# Altium project Practica RADAR.PrjPCB (part 1 of 3)
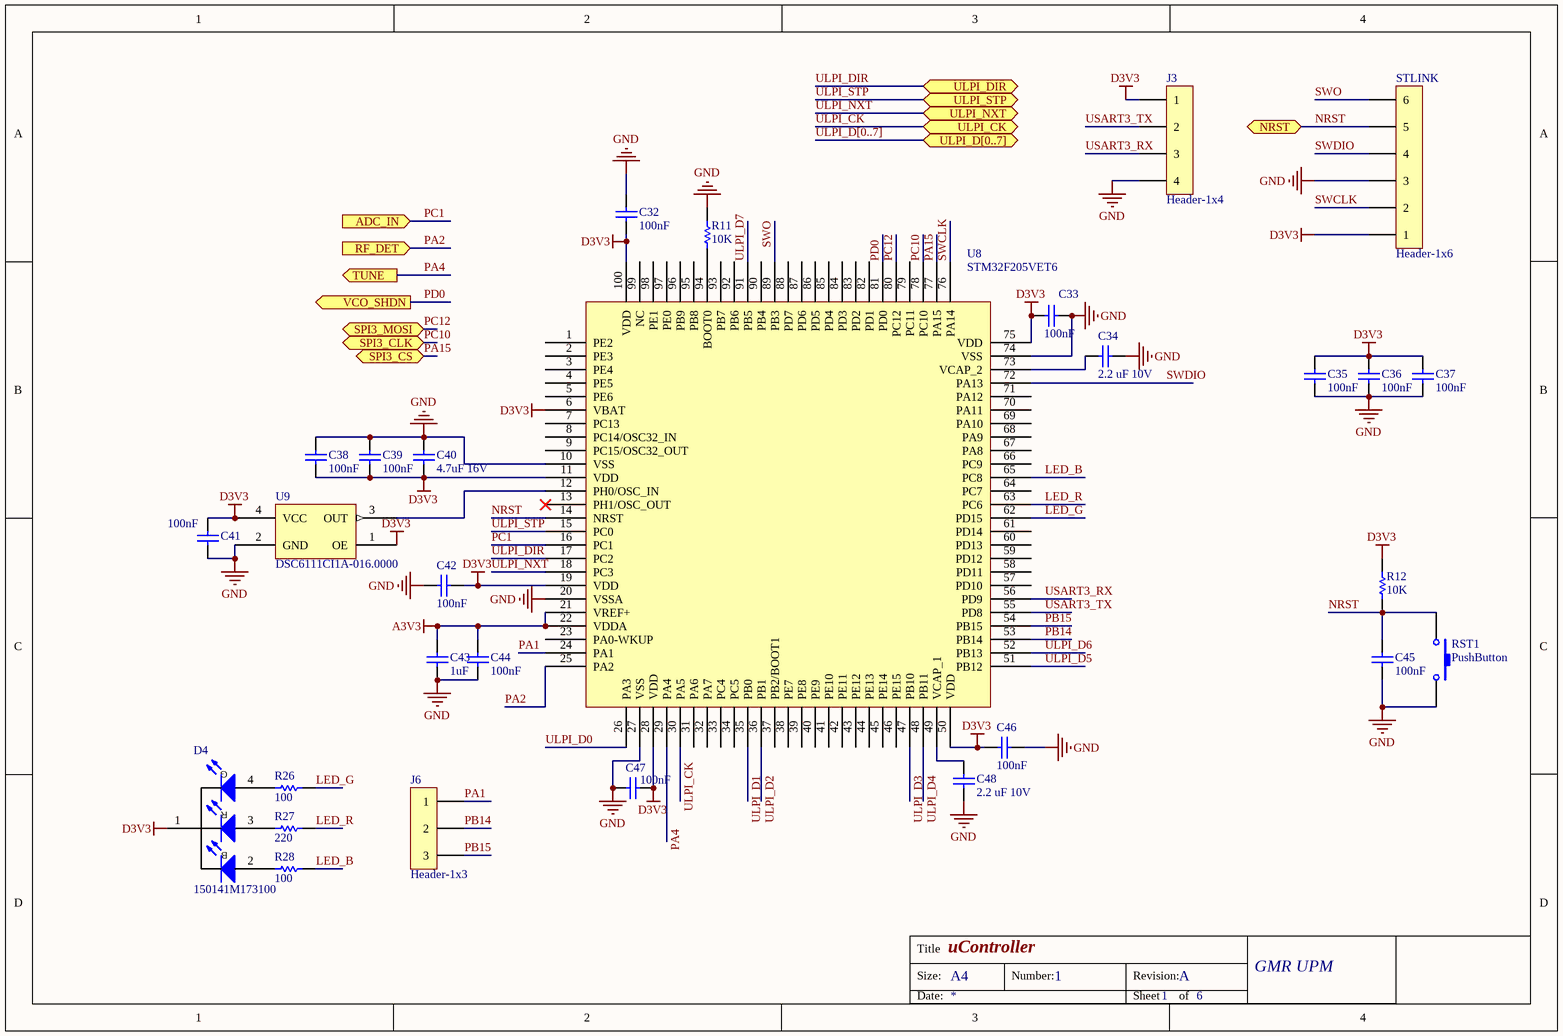
[diagram p0: uController.SchDoc]
Revision: A; ProjectName: Practica Radar; Organization: GMR UPM
6 sheets, 160 parts. Net scope: flat (ports and power ports of the same name join across sheets).
Board file: V1I1.PcbDoc
Sheets:
  uController.SchDoc
  Signal_RX.SchDoc
  Signal_TX.SchDoc
  USB PHY.SchDoc
  LowFreqSignal.SchDoc
  Power and Connectors.SchDoc

## Sheet uController.SchDoc: uController
size A4; Organization: GMR UPM; DocumentNumber: 1; Revision: A; SheetNumber: 1; SheetTotal: 6

### Parts
C32  100nF  [0603 Cap]
C33  100nF  [0603 Cap]
C34  2.2 uF 10V  [0603 Cap]
C35  100nF  [0603 Cap]
C36  100nF  [0603 Cap]
C37  100nF  [0603 Cap]
C38  100nF  [0603 Cap]
C39  100nF  [0603 Cap]
C40  4.7uF 16V  [0805 CAP]
C41  100nF  [0603 Cap]
C42  100nF  [0603 Cap]
C43  1uF  [0603 Cap]
C44  100nF  [0603 Cap]
C45  100nF  [0603 Cap]
C46  100nF  [0603 Cap]
C47  100nF  [0603 Cap]
C48  2.2 uF 10V  [0603 Cap]
D4  150141M173100  [DFN270P320X210-4N]
J3  Header-1x4  [HEADER-1X4]
J6  Header-1x3  [Header-1x3-Jumper]
R11  10K  [0603 Res]
R12  10K  [0603 Res]
R26  100  [RESC1005X04L]
R27  220  [RESC1005X04L]
R28  100  [RESC1005X04L]
RST1  PushButton  [PushButton]
STLINK  Header-1x6  [Header-1x6]
U8  STM32F205VET6  [LQFP-100]
U9  DSC6111CI1A-016.0000  [DFN 3.2x2.5]

### Ports
ADC_IN (in), NRST (bidir), RF_DET (in), SPI3_CLK (bidir), SPI3_CS (bidir), SPI3_MOSI (bidir), TUNE (out), ULPI_CK (bidir), ULPI_D[0..7] (bidir), ULPI_DIR (bidir), ULPI_NXT (bidir), ULPI_STP (bidir), VCO_SHDN (out)

### Nets
A3V3: C43.2 C44.1 U8.21(VREF+) U8.22(VDDA)
D3V3: C32.2 C33.1 C35.2 C36.2 C37.2 C38.1 C39.1 C40.1 C41.2 C42.1 C46.2 C47.1 D4.1(A) J3.1 R12.2 STLINK.1 U8.6(VBAT) U8.11(VDD) U8.19(VDD) U8.28(VDD) U8.50(VDD) U8.75(VDD) U8.100(VDD) U9.1(OE) U9.4(VCC)
GND: C32.1 C33.2 C34.1 C35.1 C36.1 C37.1 C38.2 C39.2 C40.2 C41.1 C42.2 C43.1 C44.2 C45.1 C46.1 C47.2 C48.1 J3.4 R11.2 RST1.2 STLINK.3 U8.10(VSS) U8.20(VSSA) U8.27(VSS) U8.74(VSS) U9.2(GND)
LED_B: R28.2 U8.65(PC8)
LED_G: R26.2 U8.62(PD15)
LED_R: R27.2 U8.63(PC6)
NRST: C45.2 R12.1 RST1.1 STLINK.5 U8.14(NRST) ; port NRST
PA1: J6.1 U8.24(PA1)
PA2: U8.25(PA2) ; port RF_DET
PA4: U8.29(PA4) ; port TUNE
PA15: U8.77(PA15) ; port SPI3_CS
PB14: J6.2 U8.53(PB14)
PB15: J6.3 U8.54(PB15)
PC1: U8.16(PC1) ; port ADC_IN  [project net ADC_IN]
PC10: U8.78(PC10) ; port SPI3_CLK
PC12: U8.80(PC12) ; port SPI3_MOSI
PD0: U8.81(PD0) ; port VCO_SHDN
SWCLK: STLINK.2 U8.76(PA14)
SWDIO: STLINK.4 U8.72(PA13)
SWO: STLINK.6 U8.89(PB3)
ULPI_CK: U8.30(PA5) ; port ULPI_CK
ULPI_D0: U8.26(PA3)
ULPI_D1: U8.35(PB0)
ULPI_D2: U8.36(PB1)
ULPI_D3: U8.47(PB10)
ULPI_D4: U8.48(PB11)
ULPI_D5: U8.51(PB12)
ULPI_D6: U8.52(PB13)
ULPI_D7: U8.91(PB5)
ULPI_DIR: U8.17(PC2) ; port ULPI_DIR
ULPI_NXT: U8.18(PC3) ; port ULPI_NXT
ULPI_STP: U8.15(PC0) ; port ULPI_STP
USART3_RX: J3.3 U8.56(PD9)
USART3_TX: J3.2 U8.55(PD8)
NetC34_2: C34.2 U8.73(VCAP_2)
NetC48_2: C48.2 U8.49(VCAP_1)
NetD4_2: D4.2(C) R28.1
NetD4_3: D4.3(C) R27.1
NetD4_4: D4.4(C) R26.1
NetR11_1: R11.1 U8.94(BOOT0)
NetU8_12: U8.12(PH0/OSC_IN) U9.3(OUT)

Not connected (* = marked no-connect by the designer): U8 1(PE2) 2(PE3) 3(PE4) 4(PE5) 5(PE6) 7(PC13) 8(PC14/OSC32_IN) 9(PC15/OSC32_OUT) 13(PH1/OSC_OUT)* 23(PA0-WKUP) 31(PA6) 32(PA7) 33(PC4) 34(PC5) 37(PB2/BOOT1) 38(PE7) 39(PE8) 40(PE9) 41(PE10) 42(PE11) 43(PE12) 44(PE13) 45(PE14) 46(PE15) 57(PD10) 58(PD11) 59(PD12) 60(PD13) 61(PD14) 64(PC7) 66(PC9) 67(PA8) 68(PA9) 69(PA10) 70(PA11) 71(PA12) 79(PC11) 82(PD1) 83(PD2) 84(PD3) 85(PD4) 86(PD5) 87(PD6) 88(PD7) 90(PB4) 92(PB6) 93(PB7) 95(PB8) 96(PB9) 97(PE0) 98(PE1) 99(NC)

### Buses and harness runs
bus ULPI_D[0..7] = port ULPI_D[0..7]

### Notes on the sheet
- Title
- Size:
- A4
- Number:
- Revision:
- Date:
- Sheet
- of
- (in symbol 150141M173100) G; R; B

### Library data of the parts
C32 C33 C35-C39 C41 C42 C44-C47 = C0603C104K4RACTU: CAP CER 0.1UF 16V X7R 0603; Manufacturer: KEMET; Capacitance: 0.1µF; Tolerance: ±10%; Supplier 1: Digi-Key; Manufacturer Part Number: C0603C104K4RACTU; RoHS: RoHS Compliant; Category: Capacitors; Stock 1: 4491346; Pricing 1: 1=0.09, 10=0.022, 25=0.016, 50=0.0122, 100=0.01, 250=0.00836, 500=0.0071, 1000=0.00559 (EUR); Packaging: Digi-Reel®; Part Status: Active; Voltage - Rated: 16V; Temperature Coefficient: X7R; Operating Temperature: -55°C ~ 125°C; Features: -; Ratings: -; Applications: General Purpose; Failure Rate: -; Mounting Type: Surface Mount, MLCC; Package / Case: 0603 (1608 Metric); Size / Dimension: 0.063" L x 0.031" W (1.60mm x 0.80mm); Height - Seated (Max): -; Thickness (Max): 0.034" (0.87mm); Lead Spacing: -; Lead Style: -; ComponentLink1URL: http://www.kemet.com/docfinder?Partnumber=C0603C104K4RACTU; ComponentLink1Description: http://www.kemet.com/docfinder?Partnumber=C0603C104K4RACTU; Supplier Part Number 1: 399-1096-6-ND
C34 C48 = CL10B225KP8NNNC: CAP CER 2.2UF 10V X7R 0603; Manufacturer: Samsung Electro-Mechanics America, Inc.; Capacitance: 2.2µF; Tolerance: ±10%; Supplier 1: Digi-Key; Manufacturer Part Number: CL10B225KP8NNNC; RoHS: RoHS Compliant; Category: Capacitors; Stock 1: 226342; Pricing 1: 1=0.15, 10=0.105, 25=0.0764, 50=0.0592, 100=0.0491, 250=0.04068, 500=0.03444, 1000=0.02851 (EUR); Packaging: Digi-Reel®; Part Status: Active; Voltage - Rated: 10V; Temperature Coefficient: X7R; Operating Temperature: -55°C ~ 125°C; Features: -; Ratings: -; Applications: General Purpose; Mounting Type: Surface Mount, MLCC; Package / Case: 0603 (1608 Metric); Size / Dimension: 0.063" L x 0.031" W (1.60mm x 0.80mm); Height - Seated (Max): -; Thickness (Max): 0.035" (0.90mm); Lead Spacing: -; Lead Style: -; ComponentLink1URL: http://www.samsungsem.com/kr/support/product-search/mlcc/__icsFiles/afieldfile/2016/08/18/S_CL10B225KP8NNNC.pdf; ComponentLink1Description: http://www.samsungsem.com/kr/support/product-search/mlcc/__icsFiles/afieldfile/2016/08/18/S_CL10B225KP8NNNC.pdf; Supplier Part Number 1: 1276-1134-6-ND
C40 = GRM21BR71C475KE51L: CAP CER 4.7UF 16V X7R 0805; Manufacturer: Murata Electronics North America; Capacitance: 4.7µF; Tolerance: ±10%; Supplier 1: Digi-Key; Manufacturer Part Number: GRM21BR71C475KE51L; RoHS: RoHS Compliant; Category: Capacitors; Stock 1: 5810; Pricing 1: 1=0.16, 10=0.111, 25=0.0816, 50=0.0666, 100=0.0562, 250=0.04588, 500=0.03848, 1000=0.03403 (EUR); Part Status: Active; Voltage - Rated: 16V; Temperature Coefficient: X7R; Operating Temperature: -55°C ~ 125°C; Features: -; Ratings: -; Applications: General Purpose; Failure Rate: -; Mounting Type: Surface Mount, MLCC; Package / Case: 0805 (2012 Metric); Size / Dimension: 0.079" L x 0.049" W (2.00mm x 1.25mm); Height - Seated (Max): -; Thickness (Max): 0.055" (1.40mm); Lead Spacing: -; Lead Style: -; Supplier Part Number 1: 490-14466-6-ND
C43 = CL10B105MO8NNWC: CAP CER 1UF 16V X7R 0603; Manufacturer: Samsung Electro-Mechanics America, Inc.; Capacitance: 1µF; Tolerance: ±20%; Supplier 1: Digi-Key; Manufacturer Part Number: CL10B105MO8NNWC; RoHS: RoHS Compliant; Category: Capacitors; Stock 1: 77746; Pricing 1: 1=0.09, 10=0.02, 25=0.0144, 50=0.0108, 100=0.0089, 250=0.00744, 500=0.00636, 1000=0.00499 (EUR); Packaging: Digi-Reel®; Part Status: Active; Voltage - Rated: 16V; Temperature Coefficient: X7R; Operating Temperature: -55°C ~ 125°C; Features: -; Ratings: -; Applications: General Purpose; Mounting Type: Surface Mount, MLCC; Package / Case: 0603 (1608 Metric); Size / Dimension: 0.063" L x 0.031" W (1.60mm x 0.80mm); Height - Seated (Max): -; Thickness (Max): 0.035" (0.90mm); Lead Spacing: -; Lead Style: -; ComponentLink1URL: http://www.samsungsem.com/kr/support/library/product-catalog/__icsFiles/afieldfile/2016/09/27/MLCC.pdf; ComponentLink1Description: http://www.samsungsem.com/kr/support/library/product-catalog/__icsFiles/afieldfile/2016/09/27/MLCC.pdf; Supplier Part Number 1: 1276-6524-6-ND
D4 = 150141M173100: LED RGB CLEAR 1411 SMD; Manufacturer: Wurth Electronics Inc.; Color: Red, Green, Blue (RGB); Configuration: Common Anode; Lens Color: Colorless; Millicandela Rating: 270mcd Red, 950mcd Green, 230mcd Blue; Lens Style/Size: Round with Flat Top, 2.40mm; Voltage - Forward (Vf) (Typ): 2V Red, 3.2V Green, 3.2V Blue; Current - Test: 20mA Red, 20mA Green, 20mA Blue; Viewing Angle: 120°; Wavelength - Dominant: 625nm Red, 520nm Green, 470nm Blue; Wavelength - Peak: 635nm Red, 515nm Green, 465nm Blue; Supplier 1: Digi-Key; Manufacturer Part Number: 150141M173100; RoHS: RoHS Compliant; Category: Optoelectronics; Stock 1: 7809; Pricing 1: 1=0.4, 100=0.3462, 500=0.2867 (EUR); Packaging: Cut Tape (CT); Part Status: Active; Lens Transparency: Clear; Mounting Type: Surface Mount; Features: -; Package / Case: 1411 (3528 Metric); Supplier Device Package: 3528; Size / Dimension: 3.50mm L x 2.80mm W; Height (Max): 2.10mm; ComponentLink1URL: http://katalog.we-online.de/led/datasheet/150141M173100.pdf; ComponentLink1Description: http://katalog.we-online.de/led/datasheet/150141M173100.pdf; Supplier Part Number 1: 732-4998-1-ND
R11 R12 = RC0603FR-0710KL: RES SMD 10K OHM 1% 1/10W 0603; Manufacturer: Yageo; Power (Watts): 0.1W, 1/10W; Temperature Coefficient: ±100ppm/°C; Supplier 1: Digi-Key; Manufacturer Part Number: RC0603FR-0710KL; RoHS: RoHS Compliant; Category: Resistors; Stock 1: 17023109; Pricing 1: 1=0.09, 10=0.012, 25=0.0088, 50=0.0066, 100=0.0049, 250=0.00372, 500=0.00296, 1000=0.00218 (EUR); Packaging: Cut Tape (CT); Part Status: Active; Resistance (Ohms): 10k; Tolerance: ±1%; Composition: Thick Film; Features: Moisture Resistant; Operating Temperature: -55°C ~ 155°C; Package / Case: 0603 (1608 Metric); Supplier Device Package: 0603; Size / Dimension: 0.063" L x 0.031" W (1.60mm x 0.80mm); Height - Seated (Max): 0.022" (0.55mm); Failure Rate: -; ComponentLink1URL: http://www.yageo.com/documents/recent/PYu-RC_Group_51_RoHS_L_7.pdf; ComponentLink1Description: http://www.yageo.com/documents/recent/PYu-RC_Group_51_RoHS_L_7.pdf; Supplier Part Number 1: 311-10.0KHRCT-ND
R26 R28 = MCR01MRTF1000: RES 100 OHM 1/16W 1% 0402 SMD; Manufacturer: Rohm Semiconductor; Power (Watts): 0.063W, 1/16W; Temperature Coefficient: ±100ppm/°C; Supplier 1: Digi-Key; Supplier Part Number 1: RHM100CDCT-ND; Manufacturer Part Number: MCR01MRTF1000; RoHS: RoHS Compliant; Category: Resistors; Stock 1: 128227; Pricing 1: 1=0.09, 10=0.011, 25=0.008, 100=0.0046, 250=0.00348, 500=0.00278, 1000=0.00205, 5000=0.00147 (EUR); Packaging: Cut Tape (CT); Resistance (Ohms): 100; Tolerance: ±1%; Composition: Thick Film; Features: -; Operating Temperature: -55°C ~ 155°C; Package / Case: 0402 (1005 Metric); Supplier Device Package: 0402 (1005 Metric); Size / Dimension: 0.039" L x 0.020" W (1.00mm x 0.50mm); Height: 0.016" (0.40mm); Number of Terminations: 2; ComponentLink1URL: http://rohmfs.rohm.com/en/products/databook/datasheet/passive/resistor/chip_resistor/mcr_g.pdf; ComponentLink1Description: http://rohmfs.rohm.com/en/products/databook/datasheet/passive/resistor/chip_resistor/mcr_g.pdf
R27 = RC0402FR-07220RL: RES SMD 220 OHM 1% 1/16W 0402; Manufacturer: Yageo; Power (Watts): 0.063W, 1/16W; Temperature Coefficient: ±100ppm/°C; Supplier 1: Digi-Key; Manufacturer Part Number: RC0402FR-07220RL; RoHS: RoHS Compliant; Category: Resistors; Stock 1: 624682; Pricing 1: 1=0.09, 10=0.011, 25=0.0084, 50=0.0062, 100=0.0046, 250=0.00348, 500=0.00278, 1000=0.00205, 5000=0.00147 (EUR); Packaging: Cut Tape (CT); Part Status: Active; Resistance (Ohms): 220; Tolerance: ±1%; Composition: Thick Film; Features: Moisture Resistant; Operating Temperature: -55°C ~ 155°C; Package / Case: 0402 (1005 Metric); Supplier Device Package: 0402; Size / Dimension: 0.039" L x 0.020" W (1.00mm x 0.50mm); Height - Seated (Max): 0.016" (0.40mm); Number of Terminations: 2; Failure Rate: -; ComponentLink1URL: http://www.yageo.com/NewPortal/yageodocoutput?fileName=/pdf/R-Chip/PYu-RC_Group_51_RoHS_L_4.pdf; ComponentLink1Description: http://www.yageo.com/NewPortal/yageodocoutput?fileName=/pdf/R-Chip/PYu-RC_Group_51_RoHS_L_4.pdf; Supplier Part Number 1: 311-220LRCT-ND
U8 = STM32F205VET6: IC MCU 32BIT 512KB FLASH 100LQFP; Manufacturer: STMicroelectronics; Core Processor: ARM® Cortex®-M3; Core Size: 32-Bit; Speed: 120MHz; Connectivity: CAN, I²C, IrDA, LIN, MMC, SPI, UART/USART, USB OTG; Peripherals: Brown-out Detect/Reset, DMA, I²S, LCD, POR, PWM, WDT; Number of I/O: 82; Program Memory Size: 512KB (512K x 8); RAM Size: 132K x 8; Voltage - Supply (Vcc/Vdd): 1.8 V ~ 3.6 V; Data Converters: A/D 16x12b; D/A 2x12b; Oscillator Type: Internal; Supplier 1: Digi-Key; Manufacturer Part Number: STM32F205VET6; RoHS: RoHS Compliant; Category: Integrated Circuits (ICs); Stock 1: 1188; Pricing 1: 1=9.78, 10=8.83, 100=7.3108, 500=6.36612, 1000=5.54468 (EUR); Packaging: Tray; Part Status: Active; Program Memory Type: FLASH; EEPROM Size: -; Operating Temperature: -40°C ~ 85°C (TA); Package / Case: 100-LQFP; Supplier Device Package: 100-LQFP (14x14); ComponentLink1URL: http://media.digikey.com/pdf/Data%20Sheets/ST%20Microelectronics%20PDFS/STM32F20(5,7)xx.pdf; ComponentLink1Description: http://media.digikey.com/pdf/Data%20Sheets/ST%20Microelectronics%20PDFS/STM32F20(5,7)xx.pdf; Supplier Part Number 1: 497-11160-ND
U9 = DSC6111CI1A-016.0000: ULTRA-LOW POWER,MEMS OSCILLATOR,; Manufacturer: Microchip Technology; Frequency: 16MHz; Function: Standby (Power Down); Output: CMOS; Voltage - Supply: 1.71 V ~ 3.63 V; Frequency Stability: ±25ppm; Current - Supply (Max): 3mA (Typ); Current - Supply (Disable) (Max): 10.5µA; Supplier 1: Digi-Key; Manufacturer Part Number: DSC6111CI1A-016.0000; RoHS: RoHS Compliant; Category: Crystals, Oscillators, Resonators; Stock 1: 957; Pricing 1: 1=0.81, 25=0.6744, 100=0.6514 (EUR); Packaging: Tube; Part Status: Active; Type: MEMS (Silicon); Operating Temperature: -40°C ~ 85°C; Ratings: AEC-Q100; Mounting Type: Surface Mount; Package / Case: 4-SMD, No Lead; Size / Dimension: 0.126" L x 0.098" W (3.20mm x 2.50mm); Height - Seated (Max): 0.035" (0.90mm); ComponentLink1URL: http://www.microchip.com/mymicrochip/filehandler.aspx?ddocname=en587492; ComponentLink1Description: http://www.microchip.com/mymicrochip/filehandler.aspx?ddocname=en587492; Supplier Part Number 1: DSC6111CI1A-016.0000-ND

## Sheet Signal_RX.SchDoc: Signal_RX
size A4; Organization: GMR UPM; DocumentNumber: 2; Revision: A; SheetNumber: 2; SheetTotal: 6
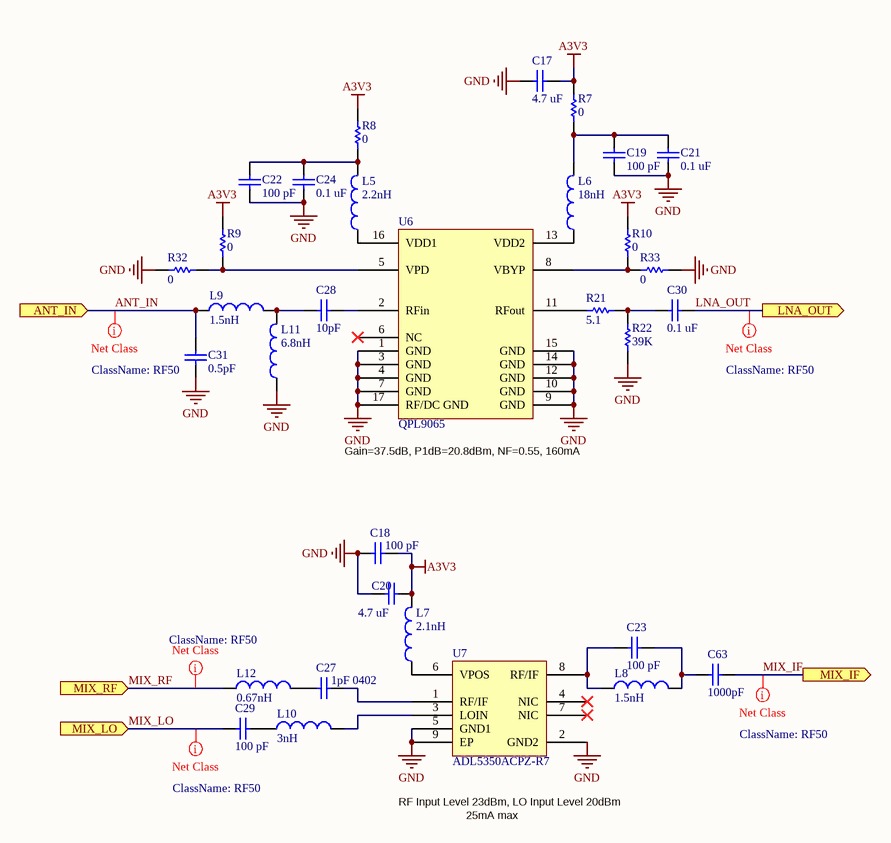
[diagram p1: Signal_RX.SchDoc]

### Parts
C17  4.7 uF  [CAPC1608X10L]
C18  100 pF  [CAPC1005X05L]
C19  100 pF  [CAPC1005X05L]
C20  4.7 uF  [CAPC1608X10L]
C21  0.1 uF  [CAPC1005X05L]
C22  100 pF  [CAPC1005X05L]
C23  100 pF  [CAPC1005X05L]
C24  0.1 uF  [CAPC1005X05L]
C27  1pF 0402  [CAPC1005X05L]
C28  10pF  [CAPC1005X05L]
C29  100 pF  [CAPC1005X05L]
C30  0.1 uF  [CAPC1005X05L]
C31  0.5pF  [CAPC1005X05L]
C63  1000pF  [CAPC1005X05L]
L5  2.2nH  [INDC1005X06L]
L6  18nH  [INDC1811X10L 0603CS]
L7  2.1nH  [INDC0905X05N-0302CS]
L8  1.5nH  [INDC1005X06L]
L9  1.5nH  [INDC1005X06L]
L10  3nH  [INDC1005X06L]
L11  6.8nH  [INDC1005X06L]
L12  0.67nH  [INDC0905X05N-0302CS]
R7  0  [RESC1005X04L]
R8  0  [RESC1005X04L]
R9  0  [RESC1005X04L]
R10  0  [RESC1005X04L]
R21  5.1  [RESC1005X04L]
R22  39K  [RESC1005X04L]
R32  0  [RESC1005X04L]
R33  0  [RESC1005X04L]
U6  QPL9065  [QFN50P350X350X86_HS-17N-qorvo]
U7  ADL5350ACPZ-R7  [SON50P200X80_HS-9N]

### Ports
ANT_IN (in), LNA_OUT (out), MIX_IF (out), MIX_LO (in), MIX_RF (in)

### Nets
A3V3: C17.2 C18.2 C20.1 L7.2 R7.2 R8.1 R9.2 R10.1
GND: C17.1 C18.1 C19.2 C20.2 C21.1 C22.2 C24.1 C31.1 L11.1 R22.1 R32.2 R33.1 U6.1(GND) U6.3(GND) U6.4(GND) U6.7(GND) U6.9(GND) U6.10(GND) U6.12(GND) U6.14(GND) U6.15(GND) U6.17(RF/DC_GND) U7.2(GND2) U7.5(GND1) U7.9(EP)
ANT_IN: C31.2 L9.1 ; port ANT_IN
LNA_OUT: C30.1 ; port LNA_OUT
MIX_IF: C63.2 ; port MIX_IF
MIX_LO: C29.1 ; port MIX_LO
MIX_RF: L12.1 ; port MIX_RF
NetC19_1: C19.1 C21.2 L6.2 R7.1
NetC22_1: C22.1 C24.2 L5.2 R8.2
NetC23_1: C23.1 L8.1 U7.8(RF/IF)
NetC23_2: C23.2 C63.1 L8.2
NetC27_1: C27.1 L12.2
NetC27_2: C27.2 U7.1(RF/IF)
NetC28_1: C28.1 L9.2 L11.2
NetC28_2: C28.2 U6.2(RFin)
NetC29_2: C29.2 L10.1
NetC30_2: C30.2 R21.2 R22.2
NetL5_1: L5.1 U6.16(VDD1)
NetL6_1: L6.1 U6.13(VDD2)
NetL7_1: L7.1 U7.6(VPOS)
NetL10_2: L10.2 U7.3(LOIN)
NetR9_1: R9.1 R32.1 U6.5(VPD)
NetR10_2: R10.2 R33.2 U6.8(VBYP)
NetR21_1: R21.1 U6.11(RFout)

Not connected (* = marked no-connect by the designer): U6 6(NC)*; U7 4(NIC)* 7(NIC)*

### Layout directives
net class RF50: ANT_IN, LNA_OUT, MIX_IF, MIX_LO, MIX_RF

### Notes on the sheet
- (near U6) Gain=37.5dB, P1dB=20.8dBm, NF=0.55, 160mA
- RF Input Level 23dBm, LO Input Level 20dBm
- 25mA max
- Title
- Size:
- A4
- Number:
- Revision:
- Date:
- Sheet
- of

### Library data of the parts
C17 = GRM188R61C475KAAJD_1: Multilayer Ceramic Capacitors MLCC - SMD/SMT 0603 4.7uF 16volts X5R + - 10%; Manufacturer: Murata Electronics; Type: General Purpose MLCC; Voltage Rating DC: 16 V; Product Status: New Product; Voltage - Rated: 16V; Supplier 1: Mouser; Manufacturer Part Number: GRM188R61C475KAAJD; RoHS: RoHS Compliant; Category: Multilayer Ceramic Capacitors MLCC - SMD/SMT; Stock 1: 10870; Pricing 1: 1=0.262, 10=0.110, 100=0.066, 1000=0.056, 4000=0.042, 8000=0.040, 24000=0.037, 48000=0.035, 100000=0.030 (EUR); Capacitance: 4.7 uF; Height: 0.8 mm; Length: 1.6 mm; Package/Case: 0603 (1608 metric); Packaging: Reel; Product: General Type MLCCs; Series: GRM; Termination Style: SMD/SMT; Tolerance: 10 %; Width: 0.8 mm; Brand: Murata Electronics; Case Code - in: 0603; Case Code - mm: 1608; Dielectric: X5R; Maximum Operating Temperature: + 85 C; Minimum Operating Temperature: - 55 C; RoHS - Mouser: Y; Minimum Order Quantity: 1; Reeling: True; ComponentLink1URL: http://www.mouser.com/ds/2/281/c02e-2905.pdf; ComponentLink1Description: http://www.mouser.com/ds/2/281/c02e-2905.pdf; Supplier 2: Digi-Key; Stock 2: 0; Pricing 2: 1=0.27, 10=0.224, 25=0.154, 50=0.1262, 100=0.112, 250=0.08404, 500=0.07424, 1000=0.06582 (EUR); Temperature Coefficient: X5R; Mounting Type: Surface Mount, MLCC; Operating Temperature: -55°C ~ 85°C; Applications: General Purpose; Ratings: -; Package / Case: 0603 (1608 Metric); Size / Dimension: 0.063" L x 0.031" W (1.60mm x 0.80mm); Height - Seated (Max): -; Thickness (Max): 0.037" (0.95mm); Lead Spacing: -; Features: -; Lead Style: -; ComponentLink2URL: http://www.murata.com/~/media/webrenewal/support/library/catalog/products/capacitor/mlcc/c02e.ashx; ComponentLink2Description: http://www.murata.com/~/media/webrenewal/support/library/catalog/products/capacitor/mlcc/c02e.ashx; Supplier Part Number 1: 81-GRM188R61C475KAJD; Supplier Part Number 2: 490-10481-1-ND
C18 C19 C22 C23 C29 = GRM1555C1H101GA01D: CAP CER 100PF 50V NP0 0402; Manufacturer: Murata Electronics North America; Tolerance: ±2%; Temperature Coefficient: C0G, NP0; Supplier 1: Digi-Key; Manufacturer Part Number: GRM1555C1H101GA01D; RoHS: RoHS Compliant; Category: Capacitors; Stock 1: 145962; Pricing 1: 1=0.09, 10=0.038, 50=0.0208, 100=0.0177, 250=0.01444, 500=0.01236, 1000=0.00963, 5000=0.00803 (EUR); Packaging: Cut Tape (CT); Capacitance: 100pF; Voltage - Rated: 50V; Mounting Type: Surface Mount, MLCC; Operating Temperature: -55°C ~ 125°C; Applications: General Purpose; Ratings: -; Package / Case: 0402 (1005 Metric); Size / Dimension: 0.039" L x 0.020" W (1.00mm x 0.50mm); Height - Seated (Max): -; Thickness (Max): 0.022" (0.55mm); Lead Spacing: -; Features: -; Lead Style: -; ComponentLink1URL: http://www.murata.com/~/media/webrenewal/support/library/catalog/products/capacitor/mlcc/c02e.ashx; ComponentLink1Description: http://www.murata.com/~/media/webrenewal/support/library/catalog/products/capacitor/mlcc/c02e.ashx; Supplier Part Number 1: 490-6188-1-ND
C20 = GRM188R61C475KAAJD: Multilayer Ceramic Capacitors MLCC - SMD/SMT 0603 4.7uF 16volts X5R + - 10%; Manufacturer: Murata Electronics; Type: General Purpose MLCC; Voltage Rating DC: 16 V; Product Status: New Product; Voltage - Rated: 16V; Supplier 1: Mouser; Manufacturer Part Number: GRM188R61C475KAAJD; RoHS: RoHS Compliant; Category: Multilayer Ceramic Capacitors MLCC - SMD/SMT; Stock 1: 10870; Pricing 1: 1=0.262, 10=0.110, 100=0.066, 1000=0.056, 4000=0.042, 8000=0.040, 24000=0.037, 48000=0.035, 100000=0.030 (EUR); Capacitance: 4.7 uF; Height: 0.8 mm; Length: 1.6 mm; Package/Case: 0603 (1608 metric); Packaging: Reel; Product: General Type MLCCs; Series: GRM; Termination Style: SMD/SMT; Tolerance: 10 %; Width: 0.8 mm; Brand: Murata Electronics; Case Code - in: 0603; Case Code - mm: 1608; Dielectric: X5R; Maximum Operating Temperature: + 85 C; Minimum Operating Temperature: - 55 C; RoHS - Mouser: Y; Minimum Order Quantity: 1; Reeling: True; ComponentLink1URL: http://www.mouser.com/ds/2/281/c02e-2905.pdf; ComponentLink1Description: http://www.mouser.com/ds/2/281/c02e-2905.pdf; Supplier 2: Digi-Key; Stock 2: 0; Pricing 2: 1=0.27, 10=0.224, 25=0.154, 50=0.1262, 100=0.112, 250=0.08404, 500=0.07424, 1000=0.06582 (EUR); Temperature Coefficient: X5R; Mounting Type: Surface Mount, MLCC; Operating Temperature: -55°C ~ 85°C; Applications: General Purpose; Ratings: -; Package / Case: 0603 (1608 Metric); Size / Dimension: 0.063" L x 0.031" W (1.60mm x 0.80mm); Height - Seated (Max): -; Thickness (Max): 0.037" (0.95mm); Lead Spacing: -; Features: -; Lead Style: -; ComponentLink2URL: http://www.murata.com/~/media/webrenewal/support/library/catalog/products/capacitor/mlcc/c02e.ashx; ComponentLink2Description: http://www.murata.com/~/media/webrenewal/support/library/catalog/products/capacitor/mlcc/c02e.ashx; Supplier Part Number 1: 81-GRM188R61C475KAJD; Supplier Part Number 2: 490-10481-1-ND
C21 C24 C30 = CL05B104KO5NNNC: CAP CER 0.1UF 16V 10% X7R 0402; Manufacturer: Samsung Electro-Mechanics America, Inc; Capacitance: 0.1µF; Supplier 1: Digi-Key; Supplier Part Number 1: 1276-1001-1-ND; Manufacturer Part Number: CL05B104KO5NNNC; RoHS: RoHS Compliant; Category: Capacitors; Stock 1: 4178896; Pricing 1: 1=0.09, 10=0.013, 25=0.0096, 100=0.0061, 500=0.00424, 1000=0.0033, 2500=0.00297, 5000=0.00275 (EUR); Packaging: Cut Tape (CT); Tolerance: ±10%; Voltage - Rated: 16V; Temperature Coefficient: X7R; Mounting Type: Surface Mount, MLCC; Operating Temperature: -55°C ~ 125°C; Applications: General Purpose; Ratings: -; Package / Case: 0402 (1005 Metric); Size / Dimension: 0.039" L x 0.020" W (1.00mm x 0.50mm); Height - Seated (Max): -; Thickness (Max): 0.022" (0.55mm); Lead Spacing: -; Features: -; Lead Style: -; ComponentLink1URL: http://www.samsungsem.com/servlet/FileDownload?type=spec&file=CL05B104KO5NNNC.pdf; ComponentLink1Description: http://www.samsungsem.com/servlet/FileDownload?type=spec&file=CL05B104KO5NNNC.pdf
C27 = GRM1555C1H1R0CA01D: CAP CER 1PF 50V C0G/NP0 0402
C28 = GRM1555C1H100JA01D: CAP CER 10PF 50V C0G/NP0 0402; Manufacturer: Murata Electronics North America; Tolerance: ±5%; Temperature Coefficient: C0G, NP0; Supplier 1: Digi-Key; Manufacturer Part Number: GRM1555C1H100JA01D; RoHS: RoHS Compliant; Category: Capacitors; Stock 1: 670265; Pricing 1: 1=0.18, 10=0.025, 100=0.0112, 500=0.008, 1000=0.00629, 2500=0.00572, 5000=0.00526 (EUR); Packaging: Cut Tape (CT); Part Status: Active; Voltage - Rated: 50V; Operating Temperature: -55°C ~ 125°C; Features: -; Ratings: -; Applications: General Purpose; Mounting Type: Surface Mount, MLCC; Package / Case: 0402 (1005 Metric); Size / Dimension: 0.039" L x 0.020" W (1.00mm x 0.50mm); Height - Seated (Max): -; Thickness (Max): 0.022" (0.55mm); Lead Spacing: -; Lead Style: -; ComponentLink1URL: http://www.murata.com/~/media/webrenewal/support/library/catalog/products/capacitor/mlcc/c02e.ashx?la=en-us; ComponentLink1Description: http://www.murata.com/~/media/webrenewal/support/library/catalog/products/capacitor/mlcc/c02e.ashx?la=en-us; Supplier Part Number 1: 490-5921-1-ND
C31 = GJM1555C1HR50BB01D: CAP CER 0.5PF 50V C0G/NP0 0402; Manufacturer: Murata Electronics North America; Tolerance: ±0.1pF; Temperature Coefficient: C0G, NP0; Supplier 1: Digi-Key; Manufacturer Part Number: GJM1555C1HR50BB01D; RoHS: RoHS Compliant; Category: Capacitors; Stock 1: 43253; Pricing 1: 1=0.14, 10=0.101, 100=0.0474, 500=0.03328, 1000=0.02756, 2500=0.02564, 5000=0.02346 (EUR); Packaging: Cut Tape (CT); Part Status: Active; Voltage - Rated: 50V; Operating Temperature: -55°C ~ 125°C; Features: High Q, Low Loss; Ratings: -; Applications: RF, Microwave, High Frequency; Mounting Type: Surface Mount, MLCC; Package / Case: 0402 (1005 Metric); Size / Dimension: 0.039" L x 0.020" W (1.00mm x 0.50mm); Height - Seated (Max): -; Thickness (Max): 0.022" (0.55mm); Lead Spacing: -; Lead Style: -; ComponentLink1URL: http://search.murata.co.jp/Ceramy/image/img/A01X/G101/ENG/GJM1555C1HR50BB01-01.pdf; ComponentLink1Description: http://search.murata.co.jp/Ceramy/image/img/A01X/G101/ENG/GJM1555C1HR50BB01-01.pdf; Supplier Part Number 1: 490-6077-1-ND
C63 = GRM1555C1H102JA01D: CAP CER 1000PF 50V C0G/NP0 0402; Manufacturer: Murata Electronics North America; Tolerance: ±5%; Temperature Coefficient: C0G, NP0; Supplier 1: Digi-Key; Manufacturer Part Number: GRM1555C1H102JA01D; RoHS: RoHS Compliant; Category: Capacitors; Stock 1: 29189; Pricing 1: 1=0.12, 10=0.054, 100=0.0242, 500=0.01726, 1000=0.01355, 2500=0.01232, 5000=0.01134 (EUR); Packaging: Cut Tape (CT); Part Status: Active; Voltage - Rated: 50V; Operating Temperature: -55°C ~ 125°C; Features: -; Ratings: -; Applications: General Purpose; Mounting Type: Surface Mount, MLCC; Package / Case: 0402 (1005 Metric); Size / Dimension: 0.039" L x 0.020" W (1.00mm x 0.50mm); Height - Seated (Max): -; Thickness (Max): 0.022" (0.55mm); Lead Spacing: -; Lead Style: -; ComponentLink1URL: http://www.murata.com/~/media/webrenewal/support/library/catalog/products/capacitor/mlcc/c02e.ashx; ComponentLink1Description: http://www.murata.com/~/media/webrenewal/support/library/catalog/products/capacitor/mlcc/c02e.ashx; Supplier Part Number 1: 490-3244-1-ND
L5 = LQW15AN2N2C10D: FIXED IND 2.2NH 1A 27 MOHM SMD; Manufacturer: Murata Electronics North America; Type: Wirewound; Material - Core: Non-Magnetic; Tolerance: ±0.2nH; Shielding: Unshielded; DC Resistance (DCR): 27 mOhm Max; Q @ Freq: 25 @ 250MHz; Supplier 1: Digi-Key; Manufacturer Part Number: LQW15AN2N2C10D; RoHS: RoHS Compliant; Category: Inductors, Coils, Chokes; Stock 1: 98779; Pricing 1: 1=0.17, 10=0.154, 100=0.103, 500=0.08586, 1000=0.07212, 2500=0.06182 (EUR); Packaging: Cut Tape (CT); Part Status: Active; Ratings: -; Operating Temperature: -55°C ~ 125°C; Mounting Type: Surface Mount; Package / Case: 0402 (1005 Metric); Supplier Device Package: 0402 (1005 Metric); Size / Dimension: 0.039" L x 0.020" W (1.00mm x 0.50mm); Height - Seated (Max): 0.024" (0.60mm); ComponentLink1URL: http://search.murata.co.jp/Ceramy/image/img/P02/JELF243A-0051.pdf; ComponentLink1Description: http://search.murata.co.jp/Ceramy/image/img/P02/JELF243A-0051.pdf; Supplier Part Number 1: 490-6794-1-ND
L6 = 0603CS-18NXJLU: COILCRAFT - 0603CS-18NXJLU - INDUCTOR, RF, 18NH, 5%, 3.1GHZ, SMD
L7 = 0302CS-2N1XJLU: COILCRAFT - 0302CS-2N1XJLU - INDUCTOR, RF, 2.1NH,5%,15.94GHZ, SMD; Inductancia: 2.1; Corriente DC Nominal: 830; Encapsulado del Inductor de Alta Frecuencia: 0302 [Métrica 0805]; Construcción del Inductor: Bobinado; Resistencia DC Máxima: 0.082; Frecuencia Autorresonante Mín.: 5.94; Empaquetado: Cinta Cortada; Sustancia Extremadamente Preocupante (SVHC): No SVHC (12-Jan-2017); Encapsulado del Inductor: 0302 [Métrica 0805; Supplier 1: Farnell; Manufacturer: COILCRAFT; Manufacturer Part Number: 0302CS-2N1XJLU; RoHS: Y-EX; Stock 1: 120; Pricing 1: 1=1,21, 200=0,825, 500=0,567, 1000=0,453, 2000=0,361 (EUR); Rango de Producto: Serie 0302; Tolerancia de Inductancia: ± 5%; ComponentLink1URL: http://www.farnell.com/datasheets/1681869.pdf; ComponentLink1Description: http://www.farnell.com/datasheets/1681869.pdf; Supplier Part Number 1: 2285589
L8 L9 = LQP15MN1N5B02D: FIXED IND 1.5NH 280MA 200 MOHM; Manufacturer: Murata Electronics North America; Type: Thin Film; Material - Core: Non-Magnetic; Tolerance: ±0.1nH; Shielding: Unshielded; DC Resistance (DCR): 200 mOhm Max; Q @ Freq: 13 @ 500MHz; Supplier 1: Digi-Key; Manufacturer Part Number: LQP15MN1N5B02D; RoHS: RoHS Compliant; Category: Inductors, Coils, Chokes; Stock 1: 20118; Pricing 1: 1=0.16, 10=0.144, 100=0.0956, 500=0.07964, 1000=0.06691, 2500=0.05735 (EUR); Packaging: Cut Tape (CT); Part Status: Active; Ratings: -; Operating Temperature: -40°C ~ 85°C; Mounting Type: Surface Mount; Package / Case: 0402 (1005 Metric); Supplier Device Package: 0402 (1005 Metric); Size / Dimension: 0.039" L x 0.020" W (1.00mm x 0.50mm); Height - Seated (Max): 0.018" (0.45mm); ComponentLink1URL: http://search.murata.co.jp/Ceramy/image/img/P02/JELF243C-0007.pdf; ComponentLink1Description: http://search.murata.co.jp/Ceramy/image/img/P02/JELF243C-0007.pdf; Supplier Part Number 1: 490-1126-1-ND
L10 = LQP15MN3N0B02D: FIXED IND 3NH 190MA 400 MOHM SMD; Manufacturer: Murata Electronics North America; Type: Thin Film; Material - Core: Non-Magnetic; Tolerance: ±0.1nH; Shielding: Unshielded; DC Resistance (DCR): 400 mOhm Max; Q @ Freq: 13 @ 500MHz; Supplier 1: Digi-Key; Manufacturer Part Number: LQP15MN3N0B02D; RoHS: RoHS Compliant; Category: Inductors, Coils, Chokes; Stock 1: 25713; Pricing 1: 1=0.16, 10=0.144, 100=0.0956, 500=0.07964, 1000=0.06691, 2500=0.05735 (EUR); Packaging: Cut Tape (CT); Part Status: Active; Ratings: -; Operating Temperature: -40°C ~ 85°C; Mounting Type: Surface Mount; Package / Case: 0402 (1005 Metric); Supplier Device Package: 0402 (1005 Metric); Size / Dimension: 0.039" L x 0.020" W (1.00mm x 0.50mm); Height - Seated (Max): 0.018" (0.45mm); ComponentLink1URL: http://search.murata.co.jp/Ceramy/image/img/P02/JELF243C-0007.pdf; ComponentLink1Description: http://search.murata.co.jp/Ceramy/image/img/P02/JELF243C-0007.pdf; Supplier Part Number 1: 490-6755-1-ND
L11 = LQG15HS6N8J02D: FIXED IND 6.8NH 600MA 240 MOHM; Manufacturer: Murata Electronics North America; Type: Multilayer; Tolerance: ±5%; Shielding: Unshielded; DC Resistance (DCR): 240 mOhm Max; Q @ Freq: 8 @ 100MHz; Supplier 1: Digi-Key; Manufacturer Part Number: LQG15HS6N8J02D; RoHS: RoHS Compliant; Category: Inductors, Coils, Chokes; Stock 1: 201419; Pricing 1: 1=0.08, 10=0.051, 100=0.0335, 500=0.02792, 1000=0.02345, 2500=0.0201 (EUR); Packaging: Cut Tape (CT); Part Status: Active; Material - Core: -; Ratings: -; Operating Temperature: -55°C ~ 125°C; Mounting Type: Surface Mount; Package / Case: 0402 (1005 Metric); Supplier Device Package: 0402 (1005 Metric); Size / Dimension: 0.039" L x 0.020" W (1.00mm x 0.50mm); Height - Seated (Max): 0.022" (0.55mm); ComponentLink1URL: http://search.murata.co.jp/Ceramy/image/img/P02/JELF243B-0010.pdf; ComponentLink1Description: http://search.murata.co.jp/Ceramy/image/img/P02/JELF243B-0010.pdf; Supplier Part Number 1: 490-2621-1-ND
L12 = 0302CS-N67XKLU: COILCRAFT - 0302CS-N67XKLU - INDUCTOR, RF, 0.67NH, 10%,26GHZ, SMD; Inductancia: 0.67; Corriente DC Nominal: 1.6; Encapsulado del Inductor de Alta Frecuencia: 0302 [Métrica 0805]; Construcción del Inductor: Bobinado; Resistencia DC Máxima: 0.021; Frecuencia Autorresonante Mín.: 26; Empaquetado: Cinta Cortada; Sustancia Extremadamente Preocupante (SVHC): No SVHC (12-Jan-2017); Encapsulado del Inductor: 0302 [Métrica 0805; Supplier 1: Farnell; Manufacturer: COILCRAFT; Manufacturer Part Number: 0302CS-N67XKLU; RoHS: Y-EX; Pricing 1: 1=1,21, 200=0,825, 500=0,567, 1000=0,453 (EUR); Rango de Producto: Serie 0302; Tolerancia de Inductancia: ± 10%; ComponentLink1URL: http://www.farnell.com/datasheets/1681869.pdf; ComponentLink1Description: http://www.farnell.com/datasheets/1681869.pdf; Supplier Part Number 1: 2285624
R7-R10 R32 R33 = RC1005J000CS: RES 0.0 OHM 1/16W JUMP 0402; Manufacturer: Samsung Electro-Mechanics America, Inc; Resistance (Ohms): 0.0; Tolerance: Jumper; Power (Watts): 0.063W, 1/16W; Supplier 1: Digi-Key; Supplier Part Number 1: 1276-3480-1-ND; Manufacturer Part Number: RC1005J000CS; RoHS: RoHS Compliant; Category: Resistors; Stock 1: 2874816; Pricing 1: 1=0.09, 10=0.01, 25=0.0072, 100=0.0039, 500=0.00238, 1000=0.00174, 2500=0.00151, 5000=0.00125 (EUR); Packaging: Cut Tape (CT); Composition: Thick Film; Features: -; Temperature Coefficient: -; Operating Temperature: -55°C ~ 155°C; Package / Case: 0402 (1005 Metric); Supplier Device Package: 0402 (1005 Metric); Size / Dimension: 0.039" L x 0.020" W (1.00mm x 0.50mm); Height: 0.016" (0.40mm); Number of Terminations: 2; ComponentLink1URL: http://www.samsungsem.com/servlet/FileDownload?filename=productcatalog/pdf/Chip_Resistor.pdf; ComponentLink1Description: http://www.samsungsem.com/servlet/FileDownload?filename=productcatalog/pdf/Chip_Resistor.pdf
R21 = RC1005F5R1CS: RES SMD 5.1 OHM 1% 1/16W 0402; Manufacturer: Samsung Electro-Mechanics America, Inc.; Power (Watts): 0.063W, 1/16W; Temperature Coefficient: ±300ppm/°C; Supplier 1: Digi-Key; Manufacturer Part Number: RC1005F5R1CS; RoHS: RoHS Compliant; Category: Resistors; Stock 1: 277565; Pricing 1: 1=0.08, 10=0.012, 100=0.0048, 1000=0.00217, 2500=0.00189, 5000=0.00156 (EUR); Packaging: Cut Tape (CT); Part Status: Active; Tolerance: ±1%; Composition: Thick Film; Features: Moisture Resistant; Operating Temperature: -55°C ~ 155°C; Package / Case: 0402 (1005 Metric); Supplier Device Package: 0402; Size / Dimension: 0.039" L x 0.020" W (1.00mm x 0.50mm); Height - Seated (Max): 0.016" (0.40mm); Failure Rate: -; ComponentLink1URL: http://www.samsungsem.com/kr/support/library/product-catalog/__icsFiles/afieldfile/2015/09/22/CHIP_RESISTOR_2015.pdf; ComponentLink1Description: http://www.samsungsem.com/kr/support/library/product-catalog/__icsFiles/afieldfile/2015/09/22/CHIP_RESISTOR_2015.pdf; Supplier Part Number 1: 1276-3876-1-ND
R22 = RC0402FR-0739KL: RES SMD 39K OHM 1% 1/16W 0402; Manufacturer: Yageo; Power (Watts): 0.063W, 1/16W; Temperature Coefficient: ±100ppm/°C; Supplier 1: Digi-Key; Manufacturer Part Number: RC0402FR-0739KL; RoHS: RoHS Compliant; Category: Resistors; Stock 1: 555127; Pricing 1: 1=0.08, 10=0.012, 100=0.0046, 1000=0.0021, 2500=0.00182, 5000=0.0015 (EUR); Packaging: Cut Tape (CT); Part Status: Active; Tolerance: ±1%; Composition: Thick Film; Features: Moisture Resistant; Operating Temperature: -55°C ~ 155°C; Package / Case: 0402 (1005 Metric); Supplier Device Package: 0402; Size / Dimension: 0.039" L x 0.020" W (1.00mm x 0.50mm); Height - Seated (Max): 0.016" (0.40mm); Failure Rate: -; ComponentLink1URL: http://www.yageo.com/documents/recent/PYu-RC_Group_51_RoHS_L_7.pdf; ComponentLink1Description: http://www.yageo.com/documents/recent/PYu-RC_Group_51_RoHS_L_7.pdf; Supplier Part Number 1: 311-39.0KLRCT-ND
U6 = QPL9065: Manufacturer Part Number: 772-QPL9065TR13; Manufacturer: COILCRAFT; Inductancia: 18; Corriente DC Nominal: 700; Encapsulado del Inductor de Alta Frecuencia: 0603 [Métrica 1608]; Construcción del Inductor: Bobinado; Resistencia DC Máxima: 0.17; Tolerancia de Inductancia: ± 5%; Frecuencia Autorresonante Mín.: 3.1; Empaquetado: Cinta Cortada; Sustancia Extremadamente Preocupante (SVHC): No SVHC (12-Jan-2017); Estándar de Certificación para Automoción: AEC-Q200; Supplier 1: Farnell; RoHS: Y-EX; Stock 1: 2020; Pricing 1: 1=0,784, 200=0,586, 500=0,437, 1000=0,298 (EUR); Rango de Producto: Serie 0603; Encapsulado del Inductor: 0603 [Métrica 1608]; ComponentLink1URL: http://www.farnell.com/datasheets/1681877.pdf; ComponentLink1Description: http://www.farnell.com/datasheets/1681877.pdf; Supplier Part Number 1: 2285991
U7 = ADL5350ACPZ-R7: IC MIXER 750MHZ-4GHZ 8LFCSP; Manufacturer: Analog Devices Inc.; RF Type: Cellular, CDMA, GSM; Frequency: 750MHz ~ 4GHz; Noise Figure: 6.5dB; Current - Supply: 16.5mA; Voltage - Supply: 2.7 V ~ 3.5 V; Supplier 1: Digi-Key; Manufacturer Part Number: ADL5350ACPZ-R7; RoHS: RoHS Compliant; Category: RF/IF and RFID; Stock 1: 1344; Pricing 1: 1=5.72, 10=5.142, 100=4.2127, 500=3.58624, 1000=3.02454 (EUR); Packaging: Cut Tape (CT); Part Status: Active; Gain: -; Secondary Attributes: -; Package / Case: 8-VFDFN Exposed Pad, CSP; Supplier Device Package: 8-LFCSP-VD (3x2); ComponentLink1URL: http://www.analog.com/media/en/technical-documentation/evaluation-documentation/ADL5350.pdf; ComponentLink1Description: http://www.analog.com/media/en/technical-documentation/evaluation-documentation/ADL5350.pdf; Supplier Part Number 1: ADL5350ACPZ-R7CT-ND